# Altium schematic sheet Communication.SchDoc
size 431 x 279 mm; SheetNumber: 4; SheetTotal: 6
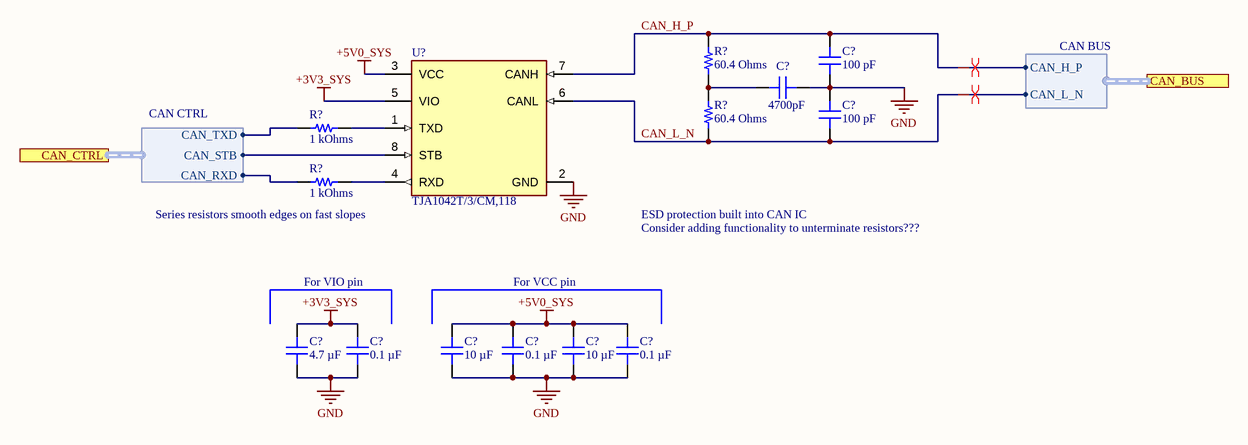
[diagram p0: Communication.SchDoc]

## Parts
(Parts that share a designator on the sheet are numbered #1, #2 ... from top to bottom, then left to right.)
C?#1  100 pF  [CAP 0603_1608]
C?#2  4700pF  [CAP 0603_1608]
C?#3  100 pF  [CAP 0603_1608]
C?#4  4.7 µF  [CAP 0603_1608]
C?#5  0.1 µF  [CAP 0603_1608]
C?#6  10 µF  [CAP 0805_2012]
C?#7  0.1 µF  [CAP 0603_1608]
C?#8  10 µF  [CAP 0805_2012]
C?#9  0.1 µF  [CAP 0603_1608]
R?#1  60.4 Ohms  [RES 0603_1608]
R?#2  60.4 Ohms  [RES 0603_1608]
R?#3  1 kOhms  [RES 0603_1608]
R?#4  1 kOhms  [RES 0603_1608]
U?  TJA1042T/3/CM,118  [FP-SOT96-1-IPC_A]

## Ports
CAN_BUS (harness CAN BUS), CAN_CTRL (harness CAN CTRL)

## Harnesses
CAN BUS: CAN_H_P, CAN_L_N
CAN CTRL: CAN_RXD, CAN_TXD, CAN_STB

## Nets
+3V3_SYS: C?#4.2 C?#5.2 U?.5(VIO)
+5V0_SYS: C?#6.2 C?#7.2 C?#8.2 C?#9.2 U?.3(VCC)
GND: C?#1.2 C?#2.2 C?#3.1 C?#4.1 C?#5.1 C?#6.1 C?#7.1 C?#8.1 C?#9.1 U?.2(GND)
CAN_H_P: C?#1.1 R?#1.2 U?.7(CANH) ; port CAN_BUS.CAN_H_P
CAN_L_N: C?#3.2 R?#2.1 U?.6(CANL) ; port CAN_BUS.CAN_L_N
NetC?#2_1: C?#2.1 R?#1.1 R?#2.2
NetR?#3_1: R?#3.1 ; port CAN_CTRL.CAN_TXD
NetR?#3_2: R?#3.2 U?.1(TXD)
NetR?#4_1: R?#4.1 ; port CAN_CTRL.CAN_RXD
NetR?#4_2: R?#4.2 U?.4(RXD)
NetU?_8: U?.8(STB) ; port CAN_CTRL.CAN_STB

## Layout directives
differential pair: CAN_H_P, CAN_L_N

## Notes on the sheet
- Series resistors smooth edges on fast slopes
- ESD protection built into CAN IC
- (near C?#5) For VIO pin
- (near C?#7) For VCC pin
- Consider adding functionality to unterminate resistors???
- DWG. NO.
- REV.
- SHT.
- THIS DOCUMENT AND THE DATA DISCLOSED HEREIN OR HEREWITH IS THE PROPERTY OF ALTIUM LIMITED AND MAY BE FREELY DISTRIBUTED IN WHOLE. NO RIGHTS ARE RESERVED OR EXPRESS OR IMPLIED WARANTEE GIVEN.
- REVISION
- DESCRIPTION
- DATE
- APPROVED
- ENG:
- APPROVALS
- PROJECT
- DSN:
- CHK:
- REFERENCE DOCUMENTS
- PROJECT REVISION:
- TITLE
- DOCUMENT REVISION:
- DESIGN ITEM:
- BOM:
- FAB DWG:
- PCB DWG:
- ASSY DWG:
- SCALE:
- SIZE
- B
- CAGE CODE
- FILE NAME
- DWG NO.
- SHEET
- OF
- REV

## Library data of the parts
C?#1 C?#3 = C0603C101K5GACAUTO: CAP CER 100PF 50V C0G/NP0 0603; manufacturer: KEMET; Temperature Coefficient: C0G, NP0; Tolerance: ±10%; Part Number: C0603C101K5GACAUTO; Value: 100 pF; Applications: Automotive; Capacitance: 100 pF; componentlink1description: Datasheet; componentlink1url: https://api.kemet.com/component-edge/download/datasheet/C0603C101K5GACAUTO.pdf; componentlink2description: DigiKey Link; componentlink2url: https://www.digikey.com/en/products/detail/kemet/C0603C101K5GACAUTO/3314842; Device Package: 0603 (1608 Metric); Features: Low ESL; lastupdated: 2022-09-19 1:01:20 PM; Lifecycle Status: Active; Minimum Order: 1; Mounting Type: Surface Mount, MLCC; Operating Temperature: -55°C ~ 125°C; Package / Case: 0603 (1608 Metric); packaging: TapeAndReel; partid: 2201; Part Status: Active; price: 0.01; Ratings: AEC-Q200; series: SMD Auto C0G; Size / Dimension: 0.063" L x 0.031" W (1.60mm x 0.80mm); Supplier 1: DigiKey; Supplier Part Number 1: 399-6843-1-ND; Thickness (Max): 0.034" (0.87mm); Voltage - Rated: 50V
C?#2 = 06031C472KAZ2A: CAP CER 4700PF 100V X7R 0603; manufacturer: AVX Corporation; Tolerance: ±10%; Part Number: 06031C472KAZ2A; Value: 4700pF; Applications: Boardflex Sensitive; Capacitance: 4700pF; componentlink1description: Datasheet; componentlink1url: http://datasheets.avx.com/FlexitermMLCC.pdf; componentlink2description: DigiKey Link; componentlink2url: http://digikey.com/product-detail/en/avx-corporation/06031C472KAZ2A/478-10224-1-ND/6797224; Device Package: 0603 (1608 Metric); Features: Soft Termination; lastupdated: 2020-09-02 1:03:34 AM; Lifecycle Status: Active; Minimum Order: 1; Mounting Type: Surface Mount, MLCC; Operating Temperature: -55°C ~ 125°C; Package / Case: 0603 (1608 Metric); packaging: TapeAndReel; partid: 3253; Part Status: Active; price: 0.05; series: FLEXITERM®; Size / Dimension: 0.063" L x 0.032" W (1.60mm x 0.81mm); Supplier 1: DigiKey; Supplier Part Number 1: 478-10224-1-ND; Temperature Coefficient: X7R; Thickness (Max): 0.035" (0.90mm); Voltage - Rated: 100V
C?#4 = CL10A475KA8NQNC: CAP CER 4.7UF 25V X5R 0603; manufacturer: Samsung Electro-Mechanics; Tolerance: ±10%; Part Number: CL10A475KA8NQNC; Value: 4.7 µF; Applications: General Purpose; Capacitance: 4.7 µF; componentlink1description: Datasheet; componentlink1url: http://www.samsungsem.com/kr/support/product-search/mlcc/CL10A475KA8NQNC.jsp; componentlink2description: DigiKey Link; componentlink2url: https://www.digikey.com/en/products/detail/samsung-electro-mechanics/CL10A475KA8NQNC/3887558; Device Package: 0603 (1608 Metric); lastupdated: 2022-09-19 1:01:20 PM; Lifecycle Status: Active; Minimum Order: 1; Mounting Type: Surface Mount, MLCC; Operating Temperature: -55°C ~ 85°C; Package / Case: 0603 (1608 Metric); packaging: TapeAndReel; partid: 2349; Part Status: Active; price: 0.06; series: CL; Size / Dimension: 0.063" L x 0.031" W (1.60mm x 0.80mm); Supplier 1: DigiKey; Supplier Part Number 1: 1276-1900-1-ND; Temperature Coefficient: X5R; Thickness (Max): 0.035" (0.90mm); Voltage - Rated: 25V
C?#5 C?#7 C?#9 = CGA3E2X7R1H104K080AE: CAP CER 0.1UF 50V X7R 0603; manufacturer: TDK Corporation; Tolerance: ±10%; Part Number: CGA3E2X7R1H104K080AE; Value: 0.1 µF; Applications: Automotive, Boardflex Sensitive; Capacitance: 0.1 µF; componentlink1description: Datasheet; componentlink1url: https://product.tdk.com/info/en/catalog/datasheets/mlcc_automotive_soft_en.pdf?ref_disty=digikey; componentlink2description: DigiKey Link; componentlink2url: https://www.digikey.com/en/products/detail/tdk-corporation/CGA3E2X7R1H104K080AE/4490594; Device Package: 0603 (1608 Metric); Features: Soft Termination; lastupdated: 2022-09-19 1:01:18 PM; Lifecycle Status: Active; Minimum Order: 1; Mounting Type: Surface Mount, MLCC; Operating Temperature: -55°C ~ 125°C; Package / Case: 0603 (1608 Metric); packaging: TapeAndReel; partid: 2715; Part Status: Active; price: 0.01; Ratings: AEC-Q200; series: CGA; Size / Dimension: 0.063" L x 0.031" W (1.60mm x 0.80mm); Supplier 1: DigiKey; Supplier Part Number 1: 445-15957-1-ND; Temperature Coefficient: X7R; Thickness (Max): 0.037" (0.95mm); Voltage - Rated: 50V
C?#6 C?#8 = C2012X5R1E106K125AB: CAP CER 10UF 25V X5R 0805; manufacturer: TDK Corporation; Tolerance: ±10%; Part Number: C2012X5R1E106K125AB; Value: 10 µF; Applications: General Purpose; Capacitance: 10 µF; componentlink1description: Datasheet; componentlink1url: https://product.tdk.com/info/en/catalog/datasheets/mlcc_commercial_general_en.pdf?ref_disty=digikey; componentlink2description: DigiKey Link; componentlink2url: https://www.digikey.com/en/products/detail/tdk-corporation/C2012X5R1E106K125AB/2443462; Device Package: 0805 (2012 Metric); Features: Low ESL; lastupdated: 2022-09-19 1:04:20 PM; Lifecycle Status: Active; Minimum Order: 1; Mounting Type: Surface Mount, MLCC; Operating Temperature: -55°C ~ 85°C; Package / Case: 0805 (2012 Metric); packaging: TapeAndReel; partid: 4850; Part Status: Active; price: 0.06; series: C; Size / Dimension: 0.079" L x 0.049" W (2.00mm x 1.25mm); Supplier 1: DigiKey; Supplier Part Number 1: 445-5984-1-ND; Temperature Coefficient: X5R; Thickness (Max): 0.057" (1.45mm); Voltage - Rated: 25V
R?#1 R?#2 = RK73H1JTTD60R4F: RES 60.4 OHM 1% 1/8W 0603; Manufacturer: KOA Speer Electronics, Inc.; Power (Watts): 0.125W, 1/8W; Temperature Coefficient: ±100ppm/°C; Part Number: RK73H1JTTD60R4F; Value: 60.4 Ohms; ComponentLink1Description: Datasheet; ComponentLink1URL: http://www.koaspeer.com/catimages/Products/RK73H/RK73H.pdf; ComponentLink2Description: DigiKey Link; ComponentLink2URL: https://www.digikey.com/en/products/detail/koa-speer-electronics-inc/RK73H1JTTD60R4F/9845016; Composition: Thick Film; Device Package: 0603 (1608 Metric); Features: Automotive AEC-Q200, Moisture Resistant; Height - Seated (Max): 0.022" (0.55mm); LastUpdated: 2022-09-19 1:22:33 PM; Lifecycle Status: Active; Minimum Order: 1; Number of Terminations: 2; Operating Temperature: -55°C ~ 155°C; Package / Case: 0603 (1608 Metric); Packaging: CutTape; PartId: 5191; Part Status: Active; Price: 0.01; Ratings: AEC-Q200; Resistance: 60.4 Ohms; Series: RK73H; Size / Dimension: 0.063" L x 0.031" W (1.60mm x 0.80mm); Supplier 1: DigiKey; Supplier Part Number 1: 2019-RK73H1JTTD60R4FCT-ND; Supplier Device Package: 0603; Tolerance: ±1%
R?#3 R?#4 = RT0603FRE071KL: RES SMD 1K OHM 1% 1/10W 0603; Manufacturer: Yageo; Power (Watts): 0.1W, 1/10W; Temperature Coefficient: ±50ppm/°C; Part Number: RT0603FRE071KL; Value: 1 kOhms; ComponentLink1Description: Datasheet; ComponentLink1URL: https://www.yageo.com/upload/media/product/productsearch/datasheet/rchip/PYu-RT_1-to-0.01_RoHS_L_11.pdf; ComponentLink2Description: DigiKey Link; ComponentLink2URL: https://www.digikey.com/en/products/detail/yageo/RT0603FRE071KL/1075188; Composition: Thin Film; Device Package: 0603 (1608 Metric); Height - Seated (Max): 0.022" (0.55mm); LastUpdated: 2022-09-19 1:22:31 PM; Lifecycle Status: Active; Minimum Order: 1; Number of Terminations: 2; Operating Temperature: -55°C ~ 155°C; Package / Case: 0603 (1608 Metric); Packaging: TapeAndReel; PartId: 5672; Part Status: Active; Price: 0.01; Resistance: 1 kOhms; Series: RT; Size / Dimension: 0.063" L x 0.031" W (1.60mm x 0.80mm); Supplier 1: DigiKey; Supplier Part Number 1: YAG2323CT-ND; Supplier Device Package: 0603; Tolerance: ±1%
U? = CMP-10098-000021-1: IC TRANSCEIVER HALF 1/1 8SO; Min Supply Voltage: 4.5V; Operating Supply Voltage: 5V; Data Rate: 1Mbps; Number of Transceivers: 1; Nominal Supply Current: 70mA; Max Supply Voltage: 5.5V; Mount: Surface Mount; Contact Plating: Gold; Max Operating Temperature: 150°C; Case/Package: SO; Lead Free: Lead Free; Max Supply Current: 70mA; Number of Pins: 8; Packaging: Tape and Reel; Radiation Hardening: No; Package Quantity: 2500; Min Operating Temperature: -40°C